# EAGLE design RollerBallRacerController (EAGLE 9.4.2)
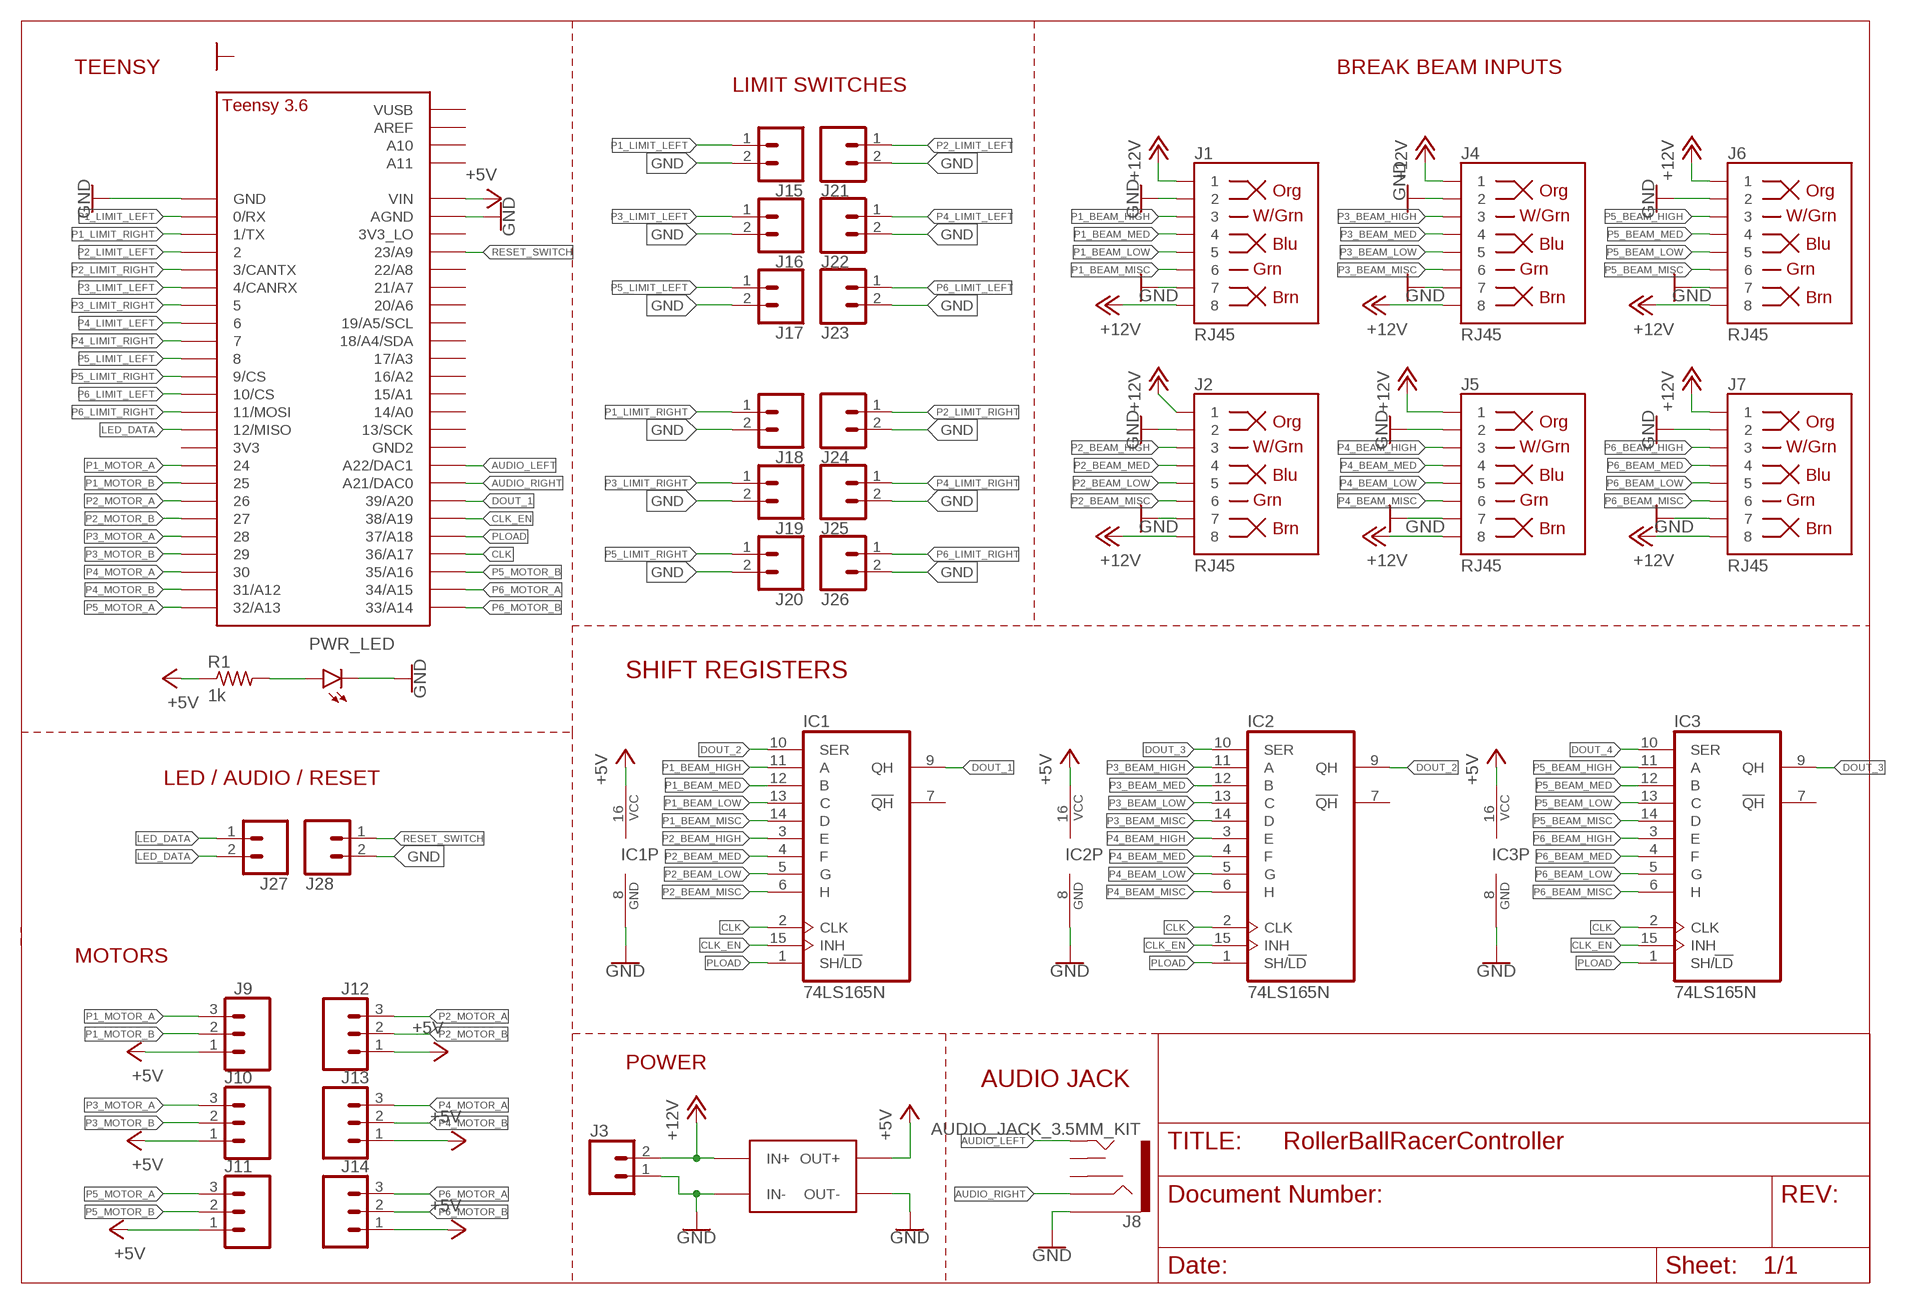
[diagram p0: schematic, sheet 1]

## Parts
IC1  74LS165N  [DIL16]
IC2  74LS165N  [DIL16]
IC3  74LS165N  [DIL16]
J1  RJ45  RJ45-8  [RJ45-8]
J2  RJ45  RJ45-8  [RJ45-8]
J3  CONN_025MM  [SCREWTERMINAL-5MM-2]
J4  RJ45  RJ45-8  [RJ45-8]
J5  RJ45  RJ45-8  [RJ45-8]
J6  RJ45  RJ45-8  [RJ45-8]
J7  RJ45  RJ45-8  [RJ45-8]
J8  AUDIO_JACK_3.5MM_KIT  [AUDIO-JACK-KIT]
J9  CONN_03POLAR  [MOLEX-1X3]
J10  CONN_03POLAR  [MOLEX-1X3]
J11  CONN_03POLAR  [MOLEX-1X3]
J12  CONN_03POLAR  [MOLEX-1X3]
J13  CONN_03POLAR  [MOLEX-1X3]
J14  CONN_03POLAR  [MOLEX-1X3]
J15  CONN_02POLAR  [MOLEX-1X2]
J16  CONN_02POLAR  [MOLEX-1X2]
J17  CONN_02POLAR  [MOLEX-1X2]
J18  CONN_02POLAR  [MOLEX-1X2]
J19  CONN_02POLAR  [MOLEX-1X2]
J20  CONN_02POLAR  [MOLEX-1X2]
J21  CONN_02POLAR  [MOLEX-1X2]
J22  CONN_02POLAR  [MOLEX-1X2]
J23  CONN_02POLAR  [MOLEX-1X2]
J24  CONN_02POLAR  [MOLEX-1X2]
J25  CONN_02POLAR  [MOLEX-1X2]
J26  CONN_02POLAR  [MOLEX-1X2]
J27  CONN_02POLAR  [MOLEX-1X2]
J28  CONN_02POLAR  [MOLEX-1X2]
PWR_LED  LED5MM  [LED5MM]
R1  1k  R-US_0204/7  [0204/7]
U$2  LM2956_DC_DC  [LM2596]
U$3  TEENSY_3.5/3.6_BASIC  [TEENSY_3.5/3.6_BASIC]

## Nets
+5V: IC1.16(VCC) IC2.16(VCC) IC3.16(VCC) J9.1 J10.1 J11.1 J12.1 J13.1 J14.1 R1.1 U$2.P$4(OUT+) U$3.VIN
+12V: J1.1 J1.8 J2.1 J2.8 J3.2 J4.1 J4.8 J5.1 J5.8 J6.1 J6.8 J7.1 J7.8 U$2.P$1(IN+)
AUDIO_LEFT: J8.TIP U$3.A22/DAC1
AUDIO_RIGHT: J8.RING U$3.21/DAC0(A21/DAC0)
CLK: IC1.2(CLK) IC2.2(CLK) IC3.2(CLK) U$3.36/A17
CLK_EN: IC1.15(INH) IC2.15(INH) IC3.15(INH) U$3.38/A19
DOUT_1: IC1.9(QH) U$3.39/A20
DOUT_2: IC1.10(SER) IC2.9(QH)
DOUT_3: IC2.10(SER) IC3.9(QH)
DOUT_4: IC3.10(SER)
GND: IC1.8(GND) IC2.8(GND) IC3.8(GND) J1.2 J1.7 J2.2 J2.7 J3.1 J4.2 J4.7 J5.2 J5.7 J6.2 J6.7 J7.2 J7.7 J8.SLEEVE J15.2 J16.2 J17.2 J18.2 J19.2 J20.2 J21.2 J22.2 J23.2 J24.2 J25.2 J26.2 J28.2 PWR_LED.K(C) U$2.P$2(IN-) U$2.P$3(OUT-) U$3.AGND U$3.GND
LED_DATA: J27.1 J27.2 U$3.12/MISO
N$1: PWR_LED.A R1.2
P1_BEAM_HIGH: IC1.11(A) J1.3
P1_BEAM_LOW: IC1.13(C) J1.5
P1_BEAM_MED: IC1.12(B) J1.4
P1_BEAM_MISC: IC1.14(D) J1.6
P1_LIMIT_LEFT: J15.1 U$3.0/RX
P1_LIMIT_RIGHT: J18.1 U$3.1/TX
P1_MOTOR_A: J9.3 U$3.24
P1_MOTOR_B: J9.2 U$3.25
P2_BEAM_HIGH: IC1.3(E) J2.3
P2_BEAM_LOW: IC1.5(G) J2.5
P2_BEAM_MED: IC1.4(F) J2.4
P2_BEAM_MISC: IC1.6(H) J2.6
P2_LIMIT_LEFT: J21.1 U$3.2
P2_LIMIT_RIGHT: J24.1 U$3.3/CANTX
P2_MOTOR_A: J12.3 U$3.26
P2_MOTOR_B: J12.2 U$3.27
P3_BEAM_HIGH: IC2.11(A) J4.3
P3_BEAM_LOW: IC2.13(C) J4.5
P3_BEAM_MED: IC2.12(B) J4.4
P3_BEAM_MISC: IC2.14(D) J4.6
P3_LIMIT_LEFT: J16.1 U$3.4/CANRX
P3_LIMIT_RIGHT: J19.1 U$3.5
P3_MOTOR_A: J10.3 U$3.28
P3_MOTOR_B: J10.2 U$3.29
P4_BEAM_HIGH: IC2.3(E) J5.3
P4_BEAM_LOW: IC2.5(G) J5.5
P4_BEAM_MED: IC2.4(F) J5.4
P4_BEAM_MISC: IC2.6(H) J5.6
P4_LIMIT_LEFT: J22.1 U$3.6
P4_LIMIT_RIGHT: J25.1 U$3.7
P4_MOTOR_A: J13.3 U$3.30
P4_MOTOR_B: J13.2 U$3.31/A12
P5_BEAM_HIGH: IC3.11(A) J6.3
P5_BEAM_LOW: IC3.13(C) J6.5
P5_BEAM_MED: IC3.12(B) J6.4
P5_BEAM_MISC: IC3.14(D) J6.6
P5_LIMIT_LEFT: J17.1 U$3.8
P5_LIMIT_RIGHT: J20.1 U$3.9/CS
P5_MOTOR_A: J11.3 U$3.32/A13
P5_MOTOR_B: J11.2 U$3.35/A16
P6_BEAM_HIGH: IC3.3(E) J7.3
P6_BEAM_LOW: IC3.5(G) J7.5
P6_BEAM_MED: IC3.4(F) J7.4
P6_BEAM_MISC: IC3.6(H) J7.6
P6_LIMIT_LEFT: J23.1 U$3.10/CS
P6_LIMIT_RIGHT: J26.1 U$3.11/MOSI
P6_MOTOR_A: J14.3 U$3.34/A15
P6_MOTOR_B: J14.2 U$3.33/A14
PLOAD: IC1.1(SH/!LD) IC2.1(SH/!LD) IC3.1(SH/!LD) U$3.37/A18
RESET_SWITCH: J28.1 U$3.23/A9
Unconnected: IC1.7(!QH) IC2.7(!QH) IC3.7(!QH) J8.RSH J8.TSH U$3.3V3 U$3.3V3_LO U$3.13/SCK U$3.14/A0 U$3.15/A1 U$3.16/A2 U$3.17/A3 U$3.18/A4/SDA U$3.19/A5/SCL U$3.20/A6 U$3.21/A7 U$3.22/A8 U$3.A10 U$3.A11 U$3.AREF U$3.GND2 U$3.VUSB

## Notes on the sheet
- TEENSY | BREAK BEAM INPUTS
- LIMIT SWITCHES
- SHIFT REGISTERS
- LED / AUDIO / RESET
- MOTORS
- POWER
- AUDIO JACK

## Library data of the parts
IC1-IC3 = 74xx-us:74*165: 8-bit parallel load SHIFT REGISTER
J1 J2 J4-J7 = SparkFun-Connectors:RJ45-8: RJ45 Jack - 8 pin Simple RJ45, 8-pin connection. Commonly used for Cat5, Cat5e, and Cat6 Ethernet cables. Here is the connector we sell at SparkFun: RJ45 8-Pin Connector <https://www.sparkfun.com/products/643> (PRT-00643) Datasheet <https://cdn.sparkfun.com/datasheets/Prototyping/04908.pdf> It is used on this SparkFun product: SparkFun RJ45 Breakout <https://www.sparkfun.com/products/716> (BOB-00716) Note, you may also be interested in the "MAGJACK" version of this. It is basically a RJ45 connector, but also has some status LEDs built into the connector housing. You can check that out in this library at the device named "MAGJACK.dev" and see these products online: RJ45 Ethernet MagJack-Compatible <https://www.sparkfun.com/products/8534> (PRT-08534) SparkFun RJ45 MagJack Breakout <https://www.sparkfun.com/products/13021> (BOB-13021); PROD_ID: CONN-08506; SF_ID: PRT-00643
J3 = SparkFun-Connectors:CONN_02: Multi connection point. Often used as Generic Header-pin footprint for 0.1 inch spaced/style header connections On any of the 0.1 inch spaced packages, you can populate with these: Break Away Headers - Straight <https://www.sparkfun.com/products/116> (PRT-00116) Break Away Male Headers - Right Angle <https://www.sparkfun.com/products/553> (PRT-00553) Female Headers <https://www.sparkfun.com/products/115> (PRT-00115) Break Away Headers - Machine Pin <https://www.sparkfun.com/products/117> (PRT-00117) Break Away Female Headers - Swiss Machine Pin <https://www.sparkfun.com/products/743> (PRT-00743) For SCREWTERMINALS and SPRING TERMINALS visit here: Screw Terimnals on SparkFun.com <https://www.sparkfun.com/search/results?term=Screw+Terminals> (5mm/3.5mm/2.54mm spacing) This device is also useful as a general connection point to wire up your design to another part of your project. Our various solder wires solder well into these plated through hole pads. Hook-Up Wire - Assortment (Stranded, 22 AWG) <https://www.sparkfun.com/products/11375> (PRT-11375) Hook-Up Wire - Assortment (Solid Core, 22 AWG) <https://www.sparkfun.com/products/11367> (PRT-11367) View the entire wire category on our website here <https://www.sparkfun.com/categories/141> Special notes: Molex polarized connector foot print use with: PRT-08233 with associated crimp pins and housings. 2.54_SCREWTERM for use with PRT-10571. 3.5mm Screw Terminal footprints for PRT-08084 5mm Screw Terminal footprints for use with PRT-08432; SF_SKU: PRT-08432
J8 = SparkFun-Connectors:AUDIO_JACK_3.5MM: Audio Jack 3.5mm variants of PTH and SMT stereo audio jack with bypass switches. SparkFun Products: SparkFun SparkPunk Sound Kit <[https://www.sparkfun.com/products/11177]> - PTH MP3 Trigger <https://www.sparkfun.com/products/13720> -3.5mm SMD SparkFun PicoBoard <https://www.sparkfun.com/products/11888>- 2.5mm SMD; PROD_ID: CONN-08774; SF_ID: PRT-08032
J9-J14 = SparkFun-Connectors:CONN_03: Multi connection point. Often used as Generic Header-pin footprint for 0.1 inch spaced/style header connections On any of the 0.1 inch spaced packages, you can populate with these: Break Away Headers - Straight <https://www.sparkfun.com/products/116> (PRT-00116) Break Away Male Headers - Right Angle <https://www.sparkfun.com/products/553> (PRT-00553) Female Headers <https://www.sparkfun.com/products/115> (PRT-00115) Break Away Headers - Machine Pin <https://www.sparkfun.com/products/117> (PRT-00117) Break Away Female Headers - Swiss Machine Pin <https://www.sparkfun.com/products/743> (PRT-00743) Stackable Header - 3 Pin (Female, 0.1") <https://www.sparkfun.com/products/13875> (PRT-13875) For SCREWTERMINALS and SPRING TERMINALS visit here: Screw Terimnals on SparkFun.com <https://www.sparkfun.com/search/results?term=Screw+Terminals> (5mm/3.5mm/2.54mm spacing) This device is also useful as a general connection point to wire up your design to another part of your project. Our various solder wires solder well into these plated through hole pads. Hook-Up Wire - Assortment (Stranded, 22 AWG) <https://www.sparkfun.com/products/11375> (PRT-11375) Hook-Up Wire - Assortment (Solid Core, 22 AWG) <https://www.sparkfun.com/products/11367> (PRT-11367) View the entire wire category on our website here <https://www.sparkfun.com/categories/141> Special notes: Molex polarized connector foot print use with SKU : PRT-08232 with associated crimp pins and housings.; PROD_ID: CONN-08625; SF_ID: PRT-08096
J15-J28 = SparkFun-Connectors:CONN_02: Multi connection point. Often used as Generic Header-pin footprint for 0.1 inch spaced/style header connections On any of the 0.1 inch spaced packages, you can populate with these: Break Away Headers - Straight <https://www.sparkfun.com/products/116> (PRT-00116) Break Away Male Headers - Right Angle <https://www.sparkfun.com/products/553> (PRT-00553) Female Headers <https://www.sparkfun.com/products/115> (PRT-00115) Break Away Headers - Machine Pin <https://www.sparkfun.com/products/117> (PRT-00117) Break Away Female Headers - Swiss Machine Pin <https://www.sparkfun.com/products/743> (PRT-00743) For SCREWTERMINALS and SPRING TERMINALS visit here: Screw Terimnals on SparkFun.com <https://www.sparkfun.com/search/results?term=Screw+Terminals> (5mm/3.5mm/2.54mm spacing) This device is also useful as a general connection point to wire up your design to another part of your project. Our various solder wires solder well into these plated through hole pads. Hook-Up Wire - Assortment (Stranded, 22 AWG) <https://www.sparkfun.com/products/11375> (PRT-11375) Hook-Up Wire - Assortment (Solid Core, 22 AWG) <https://www.sparkfun.com/products/11367> (PRT-11367) View the entire wire category on our website here <https://www.sparkfun.com/categories/141> Special notes: Molex polarized connector foot print use with: PRT-08233 with associated crimp pins and housings. 2.54_SCREWTERM for use with PRT-10571. 3.5mm Screw Terminal footprints for PRT-08084 5mm Screw Terminal footprints for use with PRT-08432; SF_ID: PRT-09918
PWR_LED = led:LED: LED OSRAM: - CHIPLED LG R971, LG N971, LY N971, LG Q971, LY Q971, LO R971, LY R971 LH N974, LH R974 LS Q976, LO Q976, LY Q976 LO Q996 - Hyper CHIPLED LW Q18S LB Q993, LB Q99A, LB R99A - SideLED LS A670, LO A670, LY A670, LG A670, LP A670 LB A673, LV A673, LT A673, LW A673 LH A674 LY A675 LS A676, LA A676, LO A676, LY A676, LW A676 LS A679, LY A679, LG A679 - Hyper Micro SIDELED® LS Y876, LA Y876, LO Y876, LY Y876 LT Y87S - SmartLED LW L88C, LW L88S LB L89C, LB L89S, LG L890 LS L89K, LO L89K, LY L89K LS L896, LA L896, LO L896, LY L896 - TOPLED LS T670, LO T670, LY T670, LG T670, LP T670 LSG T670, LSP T670, LSY T670, LOP T670, LYG T670 LG T671, LOG T671, LSG T671 LB T673, LV T673, LT T673, LW T673 LH T674 LS T676, LA T676, LO T676, LY T676, LB T676, LH T676, LSB T676, LW T676 LB T67C, LV T67C, LT T67C, LS T67K, LO T67K, LY T67K, LW E67C LS E67B, LA E67B, LO E67B, LY E67B, LB E67C, LV E67C, LT E67C LW T67C LS T679, LY T679, LG T679 LS T770, LO T770, LY T770, LG T770, LP T770 LB T773, LV T773, LT T773, LW T773 LH T774 LS E675, LA E675, LY E675, LS T675 LS T776, LA T776, LO T776, LY T776, LB T776 LHGB T686 LT T68C, LB T68C - Hyper Mini TOPLED® LB M676 - Mini TOPLED Santana® LG M470 LS M47K, LO M47K, LY M47K Source: http://www.osram.convergy.de LUXEON: - LUMILED® LXK2-PW12-R00, LXK2-PW12-S00, LXK2-PW14-U00, LXK2-PW14-V00 LXK2-PM12-R00, LXK2-PM12-S00, LXK2-PM14-U00 LXK2-PE12-Q00, LXK2-PE12-R00, LXK2-PE12-S00, LXK2-PE14-T00, LXK2-PE14-U00 LXK2-PB12-K00, LXK2-PB12-L00, LXK2-PB12-M00, LXK2-PB14-N00, LXK2-PB14-P00, LXK2-PB14-Q00 LXK2-PR12-L00, LXK2-PR12-M00, LXK2-PR14-Q00, LXK2-PR14-R00 LXK2-PD12-Q00, LXK2-PD12-R00, LXK2-PD12-S00 LXK2-PH12-R00, LXK2-PH12-S00 LXK2-PL12-P00, LXK2-PL12-Q00, LXK2-PL12-R00 Source: www.luxeon.com KINGBRIGHT: KA-3528ASYC Source: www.kingbright.com
R1 = rcl:R-US_: RESISTOR, American symbol; SPICEPREFIX: R
U$2 = EzerLonginus:LM2956_DC_DC
U$3 = Teensy356:TEENSY_3.5/3.6_BASIC

## Board
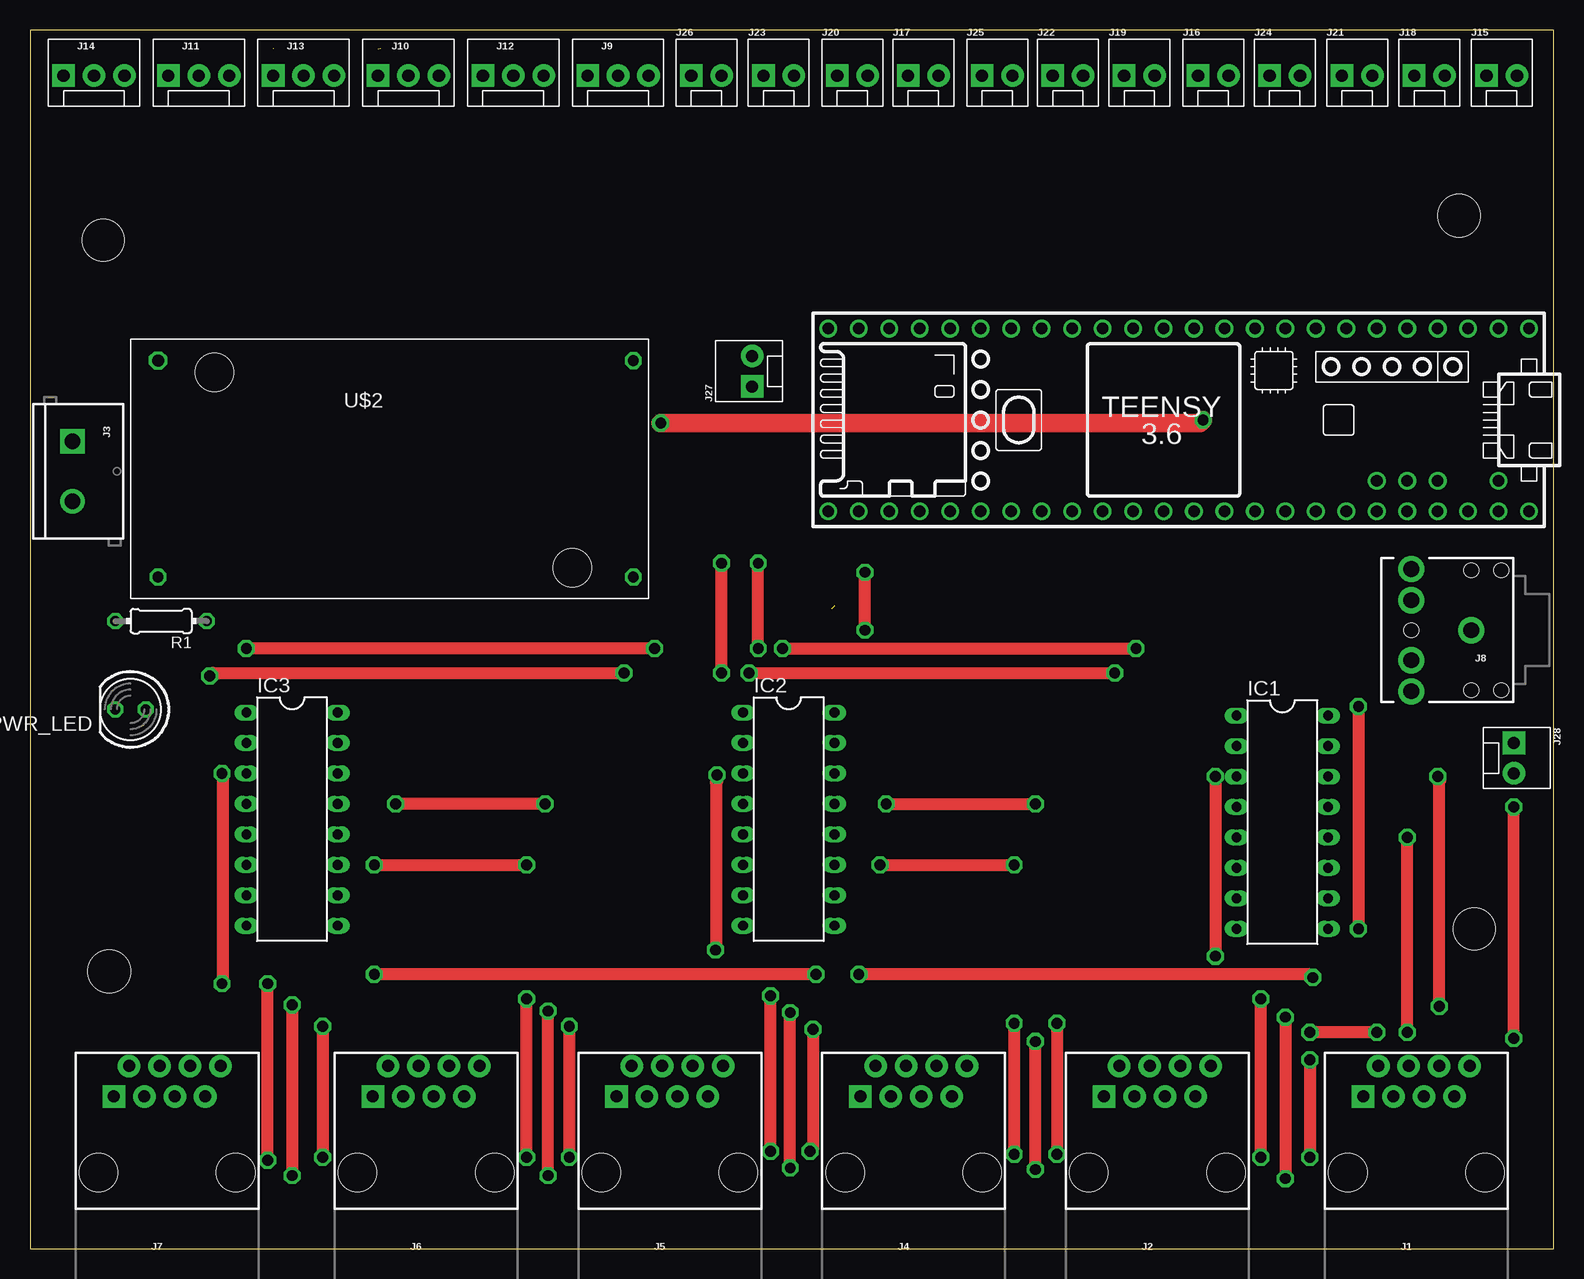
[diagram p1: board, top side]
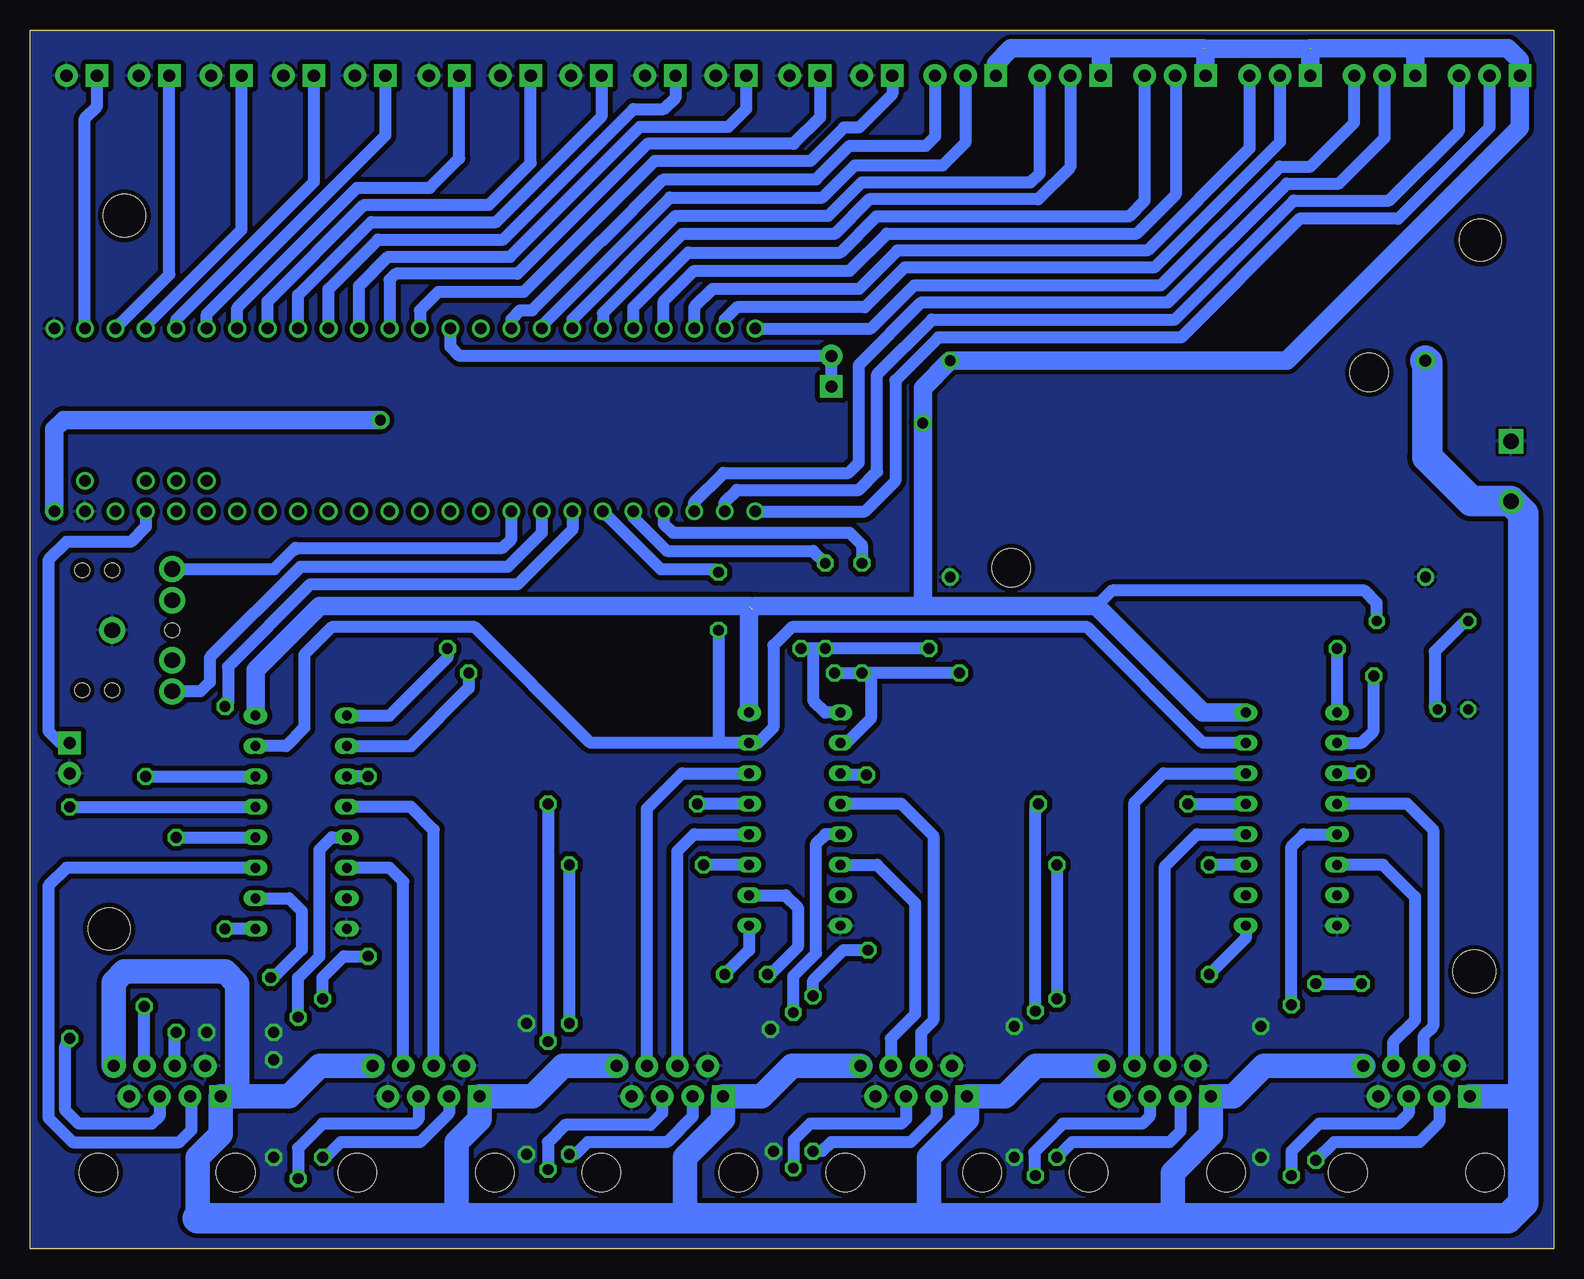
[diagram p2: board, bottom side, seen from below]

Size 127 x 101.6 mm. Coordinates in mm from the lower left corner, seen from the top.
Outline: 0,0 127,0 127,101.6 0,101.6 0,0
Copper layers (1*16): Top 0.035mm / dielectric 1.5mm / Bottom 0.035mm
Design rules "OthermillDRC_1_32_v2 *": minimum track width 8mil, minimum drill 0.8mm, track to track 16mil, track to pad 16mil, pad to pad 16mil, via to via 16mil, smd to smd 0mil, copper to edge 0mil, drill to drill 1mil, minimum pad ring 10mil, minimum via ring 10mil, stop-mask expansion 1mil, vias tented up to drill 30mil, thermal gap 10mil
Holes 3.56 mm at 6.6,23.11 119.13,86.11
Holes 3.51 mm at 6.1,84.07 120.4,26.67

### Footprints (pad centres in the part's own frame; a part is rotated, then mirrored left to right if it is on the bottom)
DIL16 = drill 0.813 long: 1 -8.89,-3.81; 2 -6.35,-3.81; 3 -3.81,-3.81; 4 -1.27,-3.81; 5 1.27,-3.81; 6 3.81,-3.81; 7 6.35,-3.81; 8 8.89,-3.81; 9 8.89,3.81; 10 6.35,3.81; 11 3.81,3.81; 12 1.27,3.81; 13 -1.27,3.81; 14 -3.81,3.81; 15 -6.35,3.81; 16 -8.89,3.81
RJ45-8 = drill 1 pad 1.88 square: 1 -4.445,6.35 | drill 1 pad 1.88: 2 -3.175,8.89; 3 -1.905,6.35; 4 -0.635,8.89; 5 0.635,6.35; 6 1.905,8.89; 7 3.175,6.35; 8 4.445,8.89 | hole 3.2: -5.715,0; 5.715,0
SCREWTERMINAL-5MM-2 = drill 1.3 pad 2.032 square: 1 0,0 | drill 1.3 pad 2.032: 2 5,0
AUDIO-JACK-KIT = drill 1.3 pad 2.184: RING 5,5.1; RSH 5,2.5; SLEEVE 0,0; TIP 5,-5.1; TSH 5,-2.5 | hole 1.2: 0,5; -2.5,5; -2.5,-5; 0,-5; 5,0
MOLEX-1X3 = drill 1.016 pad 1.88 square: 1 0,0 | drill 1.016 pad 1.88: 2 2.54,0; 3 5.08,0
MOLEX-1X2 = drill 1.016 pad 1.88 square: 1 0,0 | drill 1.016 pad 1.88: 2 2.54,0
LED5MM = drill 0.813 octagon: A -1.27,0; K 1.27,0
0204/7 = drill 0.813 octagon: 1 -3.81,0; 2 3.81,0
LM2596 = drill 1 octagon: P$1 -19.304,9.017 | drill 0.9 octagon: P$2 -19.304,-9.017; P$3 20.32,-9.017; P$4 20.32,9.017 | hole 3.175: -14.605,8.026; 15.24,-8.255
TEENSY_3.5/3.6_BASIC = drill 0.965: 0/RX -25.4,-7.62; 1/TX -22.86,-7.62; 2 -20.32,-7.62; 3/CANTX -17.78,-7.62; 3V3 7.62,-7.62; 3V3_LO -22.86,7.62; 4/CANRX -15.24,-7.62; 5 -12.7,-7.62; 6 -10.16,-7.62; 7 -7.62,-7.62; 8 -5.08,-7.62; 9/CS -2.54,-7.62; 10/CS 0,-7.62; 11/MOSI 2.54,-7.62; 12/MISO 5.08,-7.62; 13/SCK 5.08,7.62; 14/A0 2.54,7.62; 15/A1 0,7.62; 16/A2 -2.54,7.62; 17/A3 -5.08,7.62; 18/A4/SDA -7.62,7.62; 19/A5/SCL -10.16,7.62; 20/A6 -12.7,7.62; 21/A7 -15.24,7.62; 21/DAC0 12.7,7.62; 22/A8 -17.78,7.62; 23/A9 -20.32,7.62; 24 10.16,-7.62; 25 12.7,-7.62; 26 15.24,-7.62; 27 17.78,-7.62; 28 20.32,-7.62; 29 22.86,-7.62; 30 25.4,-7.62; 31/A12 27.94,-7.62; 32/A13 30.48,-7.62; 33/A14 30.48,7.62; 34/A15 27.94,7.62; 35/A16 25.4,7.62; 36/A17 22.86,7.62; 37/A18 20.32,7.62; 38/A19 17.78,7.62; 39/A20 15.24,7.62; A10 -17.78,5.08; A11 -15.24,5.08; A22/DAC1 10.16,7.62; AGND -25.4,7.62; AREF -20.32,5.08; GND -27.94,-7.62; GND2 7.62,7.62; VIN -27.94,7.62; VUSB -25.4,5.08

### Placement (x,y rotation side)
IC1  104.39,35.56 270 top
IC2  63.25,35.81 270 top
IC3  21.84,35.81 270 top
J1  115.57,6.35 0 top
J2  93.98,6.35 0 top
J3  3.56,67.31 270 top
J4  73.66,6.35 0 top
J5  53.34,6.35 0 top
J6  33.02,6.35 0 top
J7  11.43,6.35 0 top
J8  120.14,51.56 180 top
J9  46.48,97.79 0 top
J10  29.01,97.79 0 top
J11  11.53,97.79 0 top
J12  37.74,97.79 0 top
J13  20.27,97.79 0 top
J14  2.79,97.79 0 top
J15  121.41,97.79 0 top
J16  97.37,97.79 0 top
J17  73.2,97.79 0 top
J18  115.39,97.79 0 top
J19  91.21,97.79 0 top
J20  67.29,97.79 0 top
J21  109.36,97.79 0 top
J22  85.25,97.79 0 top
J23  61.14,97.79 0 top
J24  103.33,97.79 0 top
J25  79.36,97.79 0 top
J26  55.12,97.79 0 top
J27  60.2,71.88 90 top
J28  123.7,42.16 270 top
PWR_LED  8.38,44.96 180 top
R1  10.92,52.32 180 top
U$2  29.97,65.02 0 top
U$3  97.03,69.09 180 top

### Tracks (layer width: path | path; a pad name or v marks a point on that pad's centre or on a via)
+5V  (via drill 0.9)  (3 unrouted)
  Top 1.524: v97.79,69.09 97.54,68.83 v52.58,68.83
  Bottom 1.016: R1.1 14.73,53.85 15.75,54.86 36.83,54.86 38.1,53.59
  Bottom 1.524: IC2.16 67.06,53.59 102.87,53.59 108.2,48.26 IC1.16 | 66.8,53.34 66.55,53.59 52.58,53.59 | 52.58,53.59 v52.58,68.83 52.58,71.75 U$2.P$4 22.23,74.04 2.79,93.47 J14.1 2.79,99.06 3.81,100.08 11.53,100.08 | IC3.16 29.21,44.7 38.1,53.59 52.58,53.59 | U$3.VIN 124.97,68.33 124.21,69.09 v97.79,69.09 | J9.1 46.48,98.81 45.21,100.08 37.74,100.08 | 37.74,100.08 29.21,100.08 | 20.27,100.03 29.01,100.03 J10.1 | 11.53,100.08 20.27,100.08 J13.1 | J11.1 11.53,100.08 | J12.1 37.74,100.08
+12V
  Bottom 2.032: J7.1 2.54,12.7 | J7.8 24.13,15.24 26.67,12.7 J6.1 28.57,9.53 31.75,6.35 31.75,2.54 | J6.8 43.18,15.24 45.72,12.7 J5.1 48.9,10.79 52.07,7.62 52.07,2.54 | J5.8 63.5,15.24 66.04,12.7 J4.1 69.22,10.79 72.39,7.62 72.39,2.54 | 91.44,2.54 91.44,8.89 89.53,10.79 J2.1 85.09,12.7 82.55,15.24 J4.8 | J2.8 102.87,15.24 105.41,12.7 109.73,12.7 | 109.73,12.7 J1.1 111.12,9.53 113.03,7.62 113.03,2.54 | J1.8 120.02,22.23 119.13,23.11 110.74,23.11 109.73,22.1 109.73,12.7
  Bottom 2.54: 113.03,2.54 91.44,2.54 72.39,2.54 52.07,2.54 31.75,2.54 3.81,2.54 2.54,3.81 2.54,12.7 2.54,61.29 J3.2 6.86,62.31 10.54,65.99 10.54,73.91 U$2.P$1
AUDIO_LEFT
  Bottom 1.016: U$3.A22/DAC1 86.87,59.18 87.63,58.42 104.88,58.42 105.05,58.26 | J8.TIP 106.64,56.66 105.05,58.26 | 105.05,58.26 104.9,58.26
AUDIO_RIGHT
  Bottom 1.016: U$3.21/DAC0 84.33,59.69 87.19,56.83 104.46,56.83 112.01,49.28 112.01,47.24 112.8,46.46 J8.RING
CLK  (via drill 0.9)
  Top 1.016: v14.99,47.75 15.24,48.01 v49.53,48.01 | v59.94,48.01 v90.42,48.01 | v57.66,48.01 v57.66,57.15
  Bottom 1.016: IC3.2 16,42.16 14.99,43.18 v14.99,47.75 | v49.53,48.01 v57.66,48.01 | v59.94,48.01 v57.66,48.01 | v57.66,48.01 56.9,48.01 56.9,44.2 58.93,42.16 IC2.2 | IC1.2 95.25,41.91 90.42,46.74 v90.42,48.01 | U$3.36/A17 74.17,60.45 73.41,59.69 58.67,59.69 57.66,58.67 v57.66,57.15
CLK_EN  (via drill 0.9)
  Top 1.016: v69.6,51.56 v69.6,56.39
  Bottom 1.016: 69.6,42.16 IC2.15 66.29,42.16 65.02,43.43 65.02,50.29 63.5,51.82 38.86,51.82 29.21,42.16 IC3.15 | 69.6,42.16 80.26,42.16 89.92,51.82 101.85,51.82 104.14,49.53 104.14,43.43 105.66,41.91 IC1.15 | v69.6,51.56 69.6,42.16 | v69.6,56.39 69.85,56.64 74.42,56.64 U$3.38/A19
DOUT_1  (via drill 0.9)
  Top 1.016: v110.74,45.21 v110.74,26.67
  Bottom 1.016: IC1.9 v110.74,26.67 | U$3.39/A20 81.79,59.94 86.36,55.37 103.63,55.37 110.49,48.51 110.49,45.47 v110.74,45.21
DOUT_2  (via drill 0.9)
  Top 1.016: v106.93,22.61 106.68,22.86 v69.09,22.86
  Bottom 1.016: IC1.10 105.41,29.21 104.35,28.15 104.35,24.94 106.68,22.61 v106.93,22.61 | 69.34,22.86 v69.09,22.86 67.06,24.89 IC2.9
DOUT_3  (via drill 0.9)
  Top 1.016: v65.53,22.86 v28.7,22.86
  Bottom 1.016: IC2.10 64.01,29.46 62.99,28.45 62.99,25.15 65.28,22.86 v65.53,22.86 | 28.19,23.37 v28.7,22.86 25.65,25.91 IC3.9
GND  (via drill 0.9)
  Top 1.016: v106.68,15.75 v106.68,7.62 | v112.27,18.03 v106.68,18.03 | v85.6,18.8 v85.6,7.87 | v65.28,18.29 65.28,8.38 v65.02,8.13 | v44.96,18.54 v44.96,7.62 | v24.38,18.54 v24.38,7.62
  pour Bottom (isolate 0.406): 0,101.6 127,101.6 127,0 0,0
  pour Bottom (isolate 0.406): 0,101.6 127,101.6 127,0 0,0
LED_DATA
  Bottom 1.016: U$3.12/MISO 91.95,75.18 91.19,74.42 J27.2 J27.1
N$1
  Bottom 1.016: R1.2 7.37,52.32 9.91,49.78 9.91,45.21 PWR_LED.A
P1_BEAM_HIGH
  Bottom 1.016: IC1.11 123.95,31.75 125.48,30.23 125.48,10.92 123.44,8.89 114.55,8.89 113.54,9.91 113.54,12.57 J1.3
P1_BEAM_LOW  (via drill 0.9)
  Top 1.016: v123.7,17.53 v123.7,36.83
  Bottom 1.016: J1.5 116.2,11.05 116.84,10.41 122.94,10.41 124.05,11.53 124.05,16.92 123.7,17.27 v123.7,17.53 | v123.7,36.83 IC1.13
P1_BEAM_MED  (via drill 0.9)
  Top 1.016: v114.81,18.03 v114.81,34.29
  Bottom 1.016: J1.4 114.94,17.91 v114.81,18.03 | v114.81,34.29 IC1.12
P1_BEAM_MISC  (via drill 0.9)
  Top 1.016: v117.47,20.19 117.47,38.99 117.6,39.12 v117.35,39.37
  Bottom 1.016: J1.6 117.47,19.94 117.6,20.07 v117.47,20.19 | v117.35,39.37 IC1.14
P1_LIMIT_LEFT
  Bottom 1.016: U$3.0/RX 122.43,94.23 121.41,95.25 J15.1 | J15.1
P1_LIMIT_RIGHT
  Bottom 1.016: J18.1 115.39,81.21 U$3.1/TX
P1_MOTOR_A
  Bottom 1.016: J9.3 51.56,92.71 52.32,91.95 58.67,91.95 61.47,89.15 74.17,89.15 79.25,84.07 79.3,84.07 85.14,78.23 86.11,78.23 86.87,77.47 U$3.24 86.61,76.71
P1_MOTOR_B
  Bottom 1.016: U$3.25 84.33,76.96 73.66,87.63 60.94,87.63 58.25,90.32 50.9,90.32 49.02,92.2 J9.2
P2_BEAM_HIGH  (via drill 0.9)
  Top 1.016: v102.62,7.62 v102.62,20.83 | v98.81,39.37 v98.81,24.38
  Bottom 1.016: J2.3 92.08,11.3 94.49,8.89 101.09,8.89 102.36,7.62 v102.62,7.62 | 102.36,20.83 v102.62,20.83 102.62,22.61 100.84,24.38 v98.81,24.38 | v98.81,39.37 IC1.3
P2_BEAM_LOW  (via drill 0.9)
  Top 1.016: v104.65,19.3 v104.65,5.84
  Bottom 1.016: J2.5 94.61,10.79 95,10.41 102.62,10.41 104.65,8.38 v104.65,5.84 | v104.65,19.3 104.65,22.59 102.87,24.36 102.87,33.27 101.85,34.29 IC1.5
P2_BEAM_MED
  Bottom 1.016: J2.4 93.34,34.92 95.25,36.83 IC1.4
P2_BEAM_MISC
  Bottom 1.016: J2.6 95.89,30.61 97.03,31.75 IC1.6
P2_LIMIT_LEFT
  Bottom 1.016: U$3.2 117.35,76.96 109.36,84.95 J21.1
P2_LIMIT_RIGHT
  Bottom 1.016: U$3.3/CANTX 114.81,77.47 103.33,88.95 J24.1
P2_MOTOR_A
  Bottom 1.016: 42.82,97.64 J12.3 42.82,89.66 43.59,88.9 57.66,88.9 60.45,86.11 73.15,86.11 81.79,77.47 U$3.26
P2_MOTOR_B
  Bottom 1.016: U$3.27 79.25,77.98 72.64,84.58 59.94,84.58 57.05,87.48 42.98,87.48 40.28,90.17 J12.2
P3_BEAM_HIGH  (via drill 0.9)
  Top 1.016: v82.04,7.87 v82.04,18.8 | v70.87,32 v82.04,32
  Bottom 1.016: J4.3 71.75,11.05 73.91,8.89 80.52,8.89 81.53,7.87 v82.04,7.87 | IC2.11 v70.87,32 | v82.04,32 v82.04,18.8
P3_BEAM_LOW  (via drill 0.9)
  Top 1.016: v83.82,6.6 v83.82,17.27 | v71.37,37.08 v83.82,37.08
  Bottom 1.016: J4.5 74.3,11.3 75.29,10.31 82.4,10.31 83.82,8.89 v83.82,6.6 | IC2.13 v71.37,37.08 | v83.82,37.08 v83.82,17.27
P3_BEAM_MED
  Bottom 1.016: J4.4 73.03,33.15 71.63,34.54 IC2.12
P3_BEAM_MISC
  Bottom 1.016: J4.6 75.56,36.7 72.64,39.62 IC2.14
P3_LIMIT_LEFT
  Bottom 1.016: U$3.4/CANRX 112.27,77.92 97.37,92.81 J16.1
P3_LIMIT_RIGHT
  Bottom 1.016: U$3.5 109.73,78.44 99.73,88.44 93.67,88.44 91.21,90.91 J19.1
P3_MOTOR_A
  Bottom 1.016: U$3.28 76.71,78.49 72.14,83.06 59.46,83.06 56.46,86.06 35.41,86.06 34.09,87.38 J10.3
P3_MOTOR_B
  Bottom 1.016: U$3.29 74.17,78.99 71.63,81.53 58.67,81.53 55.58,84.63 34.75,84.63 31.5,87.88 31.5,97.74 J10.2
P4_BEAM_HIGH  (via drill 0.9)
  Top 1.016: v61.72,8.13 v61.72,21.08 | v57.15,24.89 57.2,24.94 57.2,38.81 57.15,38.86 57.28,38.99 v57.28,39.5
  Bottom 1.016: J5.3 51.44,11.05 53.59,8.89 60.2,8.89 60.96,8.13 v61.72,8.13 | v61.72,21.08 61.72,22.35 59.18,24.89 v57.15,24.89 | v57.28,39.5 59.31,39.5 IC2.3
P4_BEAM_LOW  (via drill 0.9)
  Top 1.016: v63.37,6.73 v63.37,19.68
  Bottom 1.016: J5.5 53.98,10.79 54.36,10.41 61.98,10.41 63.34,9.05 63.34,6.95 63.25,6.86 v63.37,6.73 | IC2.5 60.71,34.54 61.47,33.78 61.47,24.64 63.37,22.73 v63.37,19.68
P4_BEAM_MED
  Bottom 1.016: J5.4 52.7,18.03 51.69,19.05 51.69,34.42 54.36,37.08 IC2.4
P4_BEAM_MISC
  Bottom 1.016: IC2.6 56.39,32 53.21,28.83 53.21,19.56 55.24,17.53 J5.6
P4_LIMIT_LEFT
  Bottom 1.016: U$3.6 107.19,78.97 99.14,87.02 88.75,87.02 85.25,90.52 J22.1
P4_LIMIT_RIGHT
  Bottom 1.016: J25.1 79.36,94.37 88.14,85.6 98.55,85.6 104.65,79.5 U$3.7
P4_MOTOR_A
  Bottom 1.016: J13.3 25.35,91.73 33.87,83.21 54.69,83.21 57.89,80.01 70.1,80.01 71.63,78.49 U$3.30
P4_MOTOR_B
  Bottom 1.016: J13.2 22.81,92.26 33.28,81.79 54.1,81.79 57.4,78.49 68.07,78.49 69.09,77.47 U$3.31/A12
P5_BEAM_HIGH  (via drill 0.9)
  Top 1.016: v41.4,7.62 v41.4,20.83 | v28.7,32 v41.4,32
  Bottom 1.016: J6.3 31.11,9.78 32,8.89 40.13,8.89 v41.4,7.62 | v41.4,32 v41.4,20.83 | IC3.11 v28.7,32
P5_BEAM_LOW  (via drill 0.9)
  Top 1.016: v43.18,6.1 v43.18,19.81 | v42.93,37.08 v30.48,37.08
  Bottom 1.016: J6.5 33.66,11.05 34.29,10.41 40.9,10.41 43.27,8.04 43.27,6.19 v43.18,6.1 | v43.18,19.81 43.18,37.08 v42.93,37.08 | v30.48,37.08 IC3.13
P5_BEAM_MED
  Bottom 1.016: J6.4 32.38,31.88 29.72,34.54 IC3.12
P5_BEAM_MISC
  Bottom 1.016: J6.6 34.92,37.21 32.51,39.62 IC3.14
P5_LIMIT_LEFT
  Bottom 1.016: U$3.8 102.11,80.01 97.99,84.12 87.56,84.12 76.69,95 74.17,95 73.15,96.01 73.15,97.74 J17.1
P5_LIMIT_RIGHT
  Bottom 1.016: U$3.9/CS 99.57,80.26 97.13,82.7 86.97,82.7 76.15,93.52 68.78,93.52 67.29,95.02 J20.1
P5_MOTOR_A
  Bottom 1.016: U$3.32/A13 56.9,76.71 53.29,80.31 32.74,80.31 22.83,90.22 20.27,90.22 16.61,93.88 J11.3
P5_MOTOR_B
  Bottom 1.016: U$3.35/A16 71.63,62.23 69.19,64.67 58.78,64.67 57.91,65.53 57.91,73.66 52.68,78.89 32.15,78.89 22.24,88.8 17.88,88.8 14.07,92.61 J11.2
P6_BEAM_HIGH  (via drill 0.9)
  Top 1.016: v19.81,7.37 v19.81,22.1 | v16,22.1 16.05,22.15 16.05,39.57 v16,39.62
  Bottom 1.016: J7.3 9.53,10.54 11.18,8.89 18.29,8.89 v19.81,7.37 | v19.81,22.1 v16,22.1 | v16,39.62 IC3.3
P6_BEAM_LOW  (via drill 0.9)
  Top 1.016: v21.84,20.32 v21.84,6.1
  Bottom 1.016: J7.5 12.06,11.3 12.95,10.41 19.56,10.41 21.84,8.13 v21.84,6.1 | v21.84,20.32 21.84,33.53 20.83,34.54 IC3.5
P6_BEAM_MED
  Bottom 1.016: J7.4 10.79,17.78 10.03,18.54 10.03,34.92 12.19,37.08 IC3.4
P6_BEAM_MISC
  Bottom 1.016: J7.6 13.34,17.27 11.56,19.05 11.56,29.34 14.22,32 IC3.6
P6_LIMIT_LEFT
  Bottom 1.016: J23.1 61.15,94.3 63.35,92.1 75.54,92.1 86.36,81.28 96.52,81.28 97.03,80.77 U$3.10/CS
P6_LIMIT_RIGHT
  Bottom 1.016: J26.1 55.12,96.27 57.91,93.47 59.16,93.47 61.96,90.68 74.93,90.68 85.85,79.76 92.96,79.76 94.49,78.23 U$3.11/MOSI
P6_MOTOR_A
  Bottom 1.016: U$3.34/A15 69.09,62.23 68.07,63.25 57.91,63.25 56.39,64.77 56.39,72.9 51.82,77.47 31.56,77.47 21.65,87.38 13.72,87.38 7.87,93.22 J14.3
P6_MOTOR_B
  Bottom 1.016: J14.2 5.33,93.47 12.95,85.85 21.17,85.85 31.05,75.97 51.28,75.97 54.86,72.39 54.86,64.01 57.4,61.47 U$3.33/A14
PLOAD  (via drill 0.9)
  Top 1.016: v52.07,50.04 v18.03,50.04 | v62.74,50.04 v92.2,50.04 | v60.71,50.04 v60.71,57.15
  Bottom 1.016: v52.07,50.04 v60.71,50.04 61.72,50.04 | 61.72,50.04 v62.74,50.04 | IC3.1 v18.03,50.04 | v92.2,50.04 92.2,49.28 97.03,44.45 IC1.1 | 61.72,50.04 61.72,45.72 60.71,44.7 IC2.1 | U$3.37/A18 76.71,60.96 73.91,58.17 61.72,58.17 v60.71,57.15
RESET_SWITCH
  Bottom 1.016: U$3.23/A9 117.35,60.2 118.62,58.93 123.95,58.93 125.48,57.4 125.48,43.18 124.46,42.16 J28.1